# EAGLE design wiring1 (EAGLE 9.6.2)
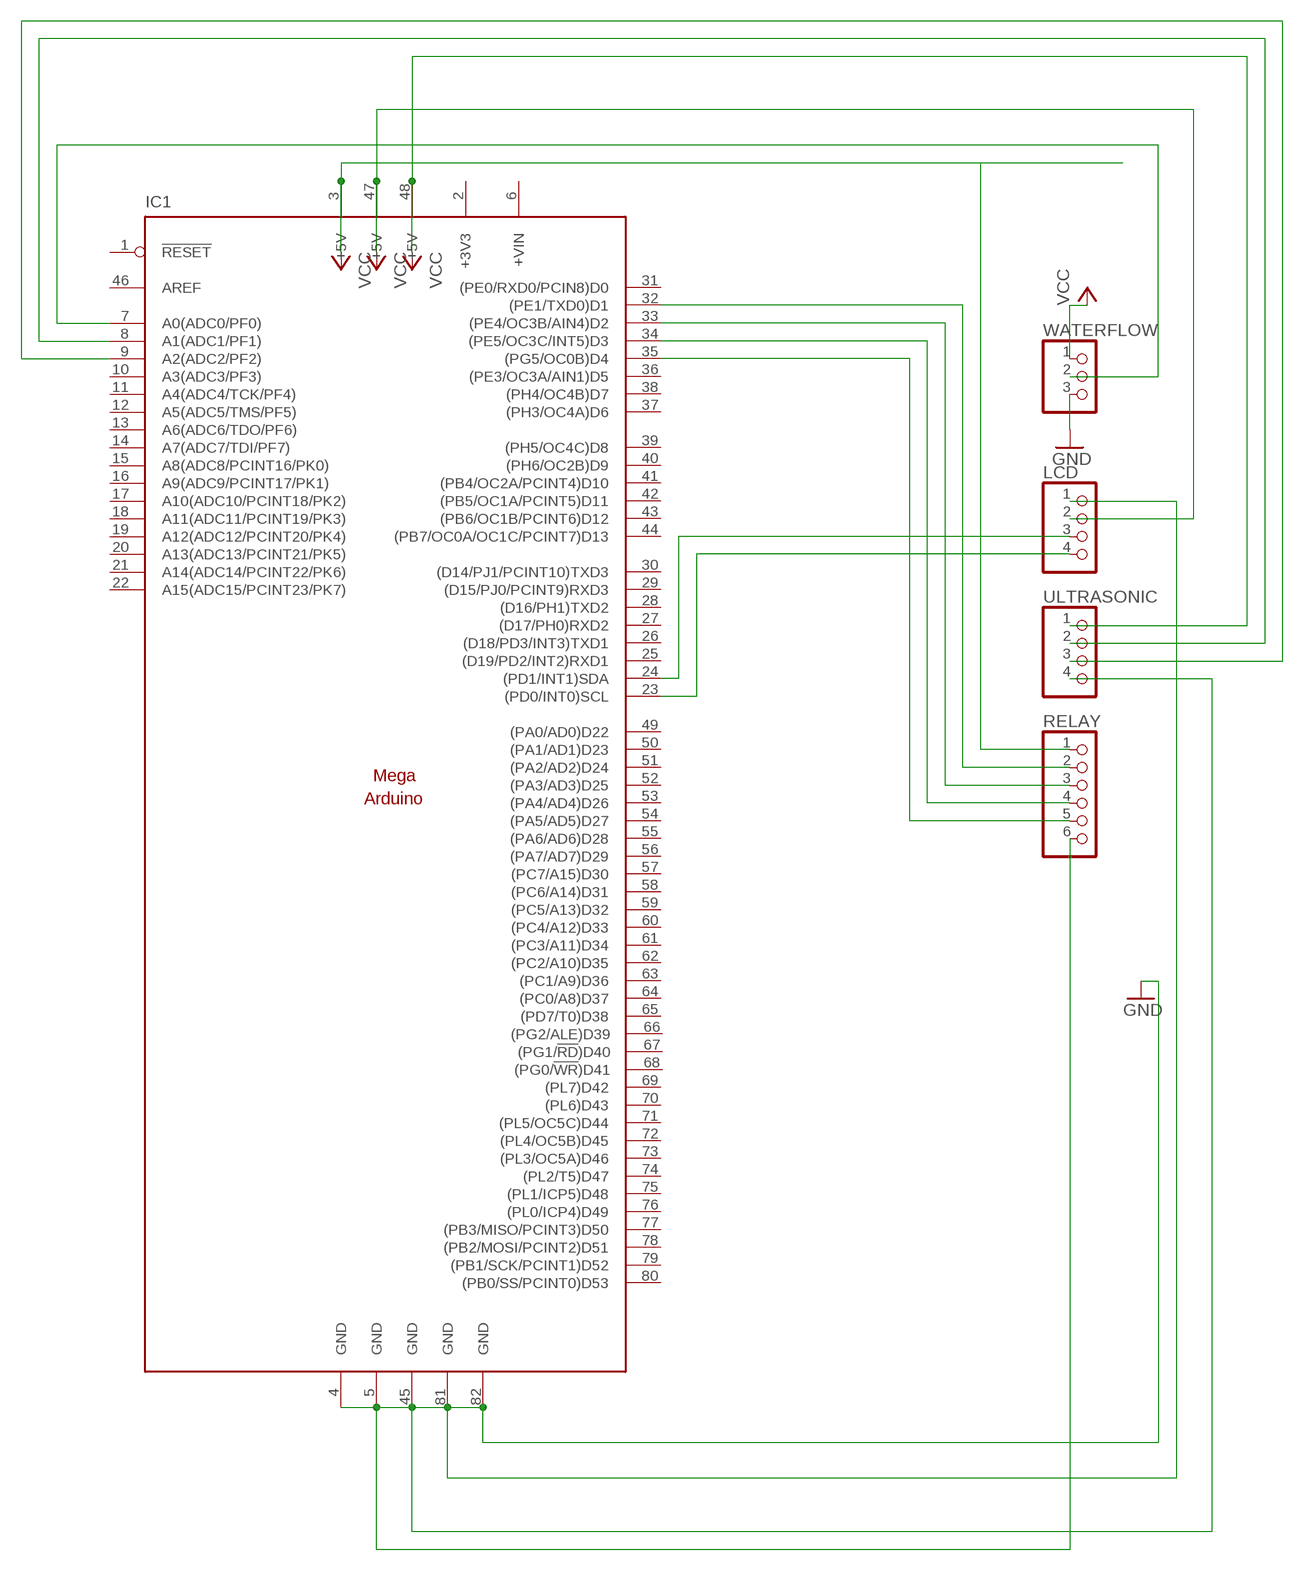
[diagram p0: schematic, sheet 1]

## Parts
IC1  ARDUINOMEGA  [ARDUINOMEGA]
LCD  PINHD-1X4  [1X04]
RELAY  PINHD-1X6  [1X06]
ULTRASONIC  PINHD-1X4  [1X04]
WATERFLOW  PINHD-1X3  [1X03]

## Nets
GND: IC1.4(GND) IC1.5(GND) IC1.45(GND) IC1.81(GND) IC1.82(GND) LCD.1 RELAY.6 ULTRASONIC.4 WATERFLOW.3
N$4: IC1.9(A2(ADC2/PF2)) ULTRASONIC.3
N$7: IC1.8(A1(ADC1/PF1)) ULTRASONIC.2
N$8: IC1.24((PD1/INT1)SDA) LCD.3
N$9: IC1.23((PD0/INT0)SCL) LCD.4
N$11: IC1.33((PE4/OC3B/AIN4)D2) RELAY.3
N$12: IC1.32((PE1/TXD0)D1) RELAY.2
N$13: IC1.34((PE5/OC3C/INT5)D3) RELAY.4
N$14: IC1.35((PG5/OC0B)D4) RELAY.5
N$15: IC1.7(A0(ADC0/PF0)) WATERFLOW.2
VCC: IC1.3(+5V) IC1.47(+5V) IC1.48(+5V) LCD.2 RELAY.1 ULTRASONIC.1 WATERFLOW.1
Unconnected: IC1.1(!RESET) IC1.10(A3(ADC3/PF3)) IC1.11(A4(ADC4/TCK/PF4)) IC1.12(A5(ADC5/TMS/PF5)) IC1.13(A6(ADC6/TDO/PF6)) IC1.14(A7(ADC7/TDI/PF7)) IC1.15(A8(ADC8/PCINT16/PK0)) IC1.16(A9(ADC9/PCINT17/PK1)) IC1.17(A10(ADC10/PCINT18/PK2)) IC1.18(A11(ADC11/PCINT19/PK3)) IC1.19(A12(ADC12/PCINT20/PK4)) IC1.20(A13(ADC13/PCINT21/PK5)) IC1.21(A14(ADC14/PCINT22/PK6)) IC1.22(A15(ADC15/PCINT23/PK7)) IC1.25((D19/PD2/INT2)RXD1) IC1.26((D18/PD3/INT3)TXD1) IC1.27((D17/PH0)RXD2) IC1.28((D16/PH1)TXD2) IC1.29((D15/PJ0/PCINT9)RXD3) IC1.30((D14/PJ1/PCINT10)TXD3) IC1.31((PE0/RXD0/PCIN8)D0) IC1.36((PE3/OC3A/AIN1)D5) IC1.37((PH3/OC4A)D6) IC1.38((PH4/OC4B)D7) IC1.39((PH5/OC4C)D8) IC1.40((PH6/OC2B)D9) IC1.41((PB4/OC2A/PCINT4)D10) IC1.42((PB5/OC1A/PCINT5)D11) IC1.43((PB6/OC1B/PCINT6)D12) IC1.44((PB7/OC0A/OC1C/PCINT7)D13) IC1.46(AREF) IC1.49((PA0/AD0)D22) IC1.50((PA1/AD1)D23) IC1.51((PA2/AD2)D24) IC1.52((PA3/AD3)D25) IC1.53((PA4/AD4)D26) IC1.54((PA5/AD5)D27) IC1.55((PA6/AD6)D28) IC1.56((PA7/AD7)D29) IC1.57((PC7/A15)D30) IC1.58((PC6/A14)D31) IC1.59((PC5/A13)D32) IC1.60((PC4/A12)D33) IC1.61((PC3/A11)D34) IC1.62((PC2/A10)D35) IC1.63((PC1/A9)D36) IC1.64((PC0/A8)D37) IC1.65((PD7/T0)D38) IC1.66((PG2/ALE)D39) IC1.67((PG1/!RD!)D40) IC1.68((PG0/!WR!)D41) IC1.69((PL7)D42) IC1.70((PL6)D43) IC1.71((PL5/OC5C)D44) IC1.72((PL4/OC5B)D45) IC1.73((PL3/OC5A)D46) IC1.74((PL2/T5)D47) IC1.75((PL1/ICP5)D48) IC1.76((PL0/ICP4)D49) IC1.77((PB3/MISO/PCINT3)D50) IC1.78((PB2/MOSI/PCINT2)D51) IC1.79((PB1/SCK/PCINT1)D52) IC1.80((PB0/SS/PCINT0)D53)

## Power pins joined to a net without a drawn wire
+3V3: IC1.2(+3V3)
+VIN: IC1.6(+VIN)

## Library data of the parts
IC1 = arduino mega 2560:ARDUINOMEGA: The Arduino Mega is a microcontroller board based on the ATmega1280. - 54 digital input/output pins (of which 14 can be used as PWM outputs) - 16 analog inputs - 4 UARTs (hardware serial ports) - 16 MHz crystal oscillator - USB connection - power jack - ICSP header - reset button It contains everything needed to support the microcontroller; simply connect it to a computer with a USB cable or power it with a AC-to-DC adapter or battery to get started. The Mega is compatible with most shields designed for the Arduino Duemilanove or Diecimila. http://arduino.cc/en/Main/ArduinoBoardMega
LCD ULTRASONIC = pinhead:PINHD-1X4: PIN HEADER
RELAY = pinhead:PINHD-1X6: PIN HEADER
WATERFLOW = pinhead:PINHD-1X3: PIN HEADER

## Board
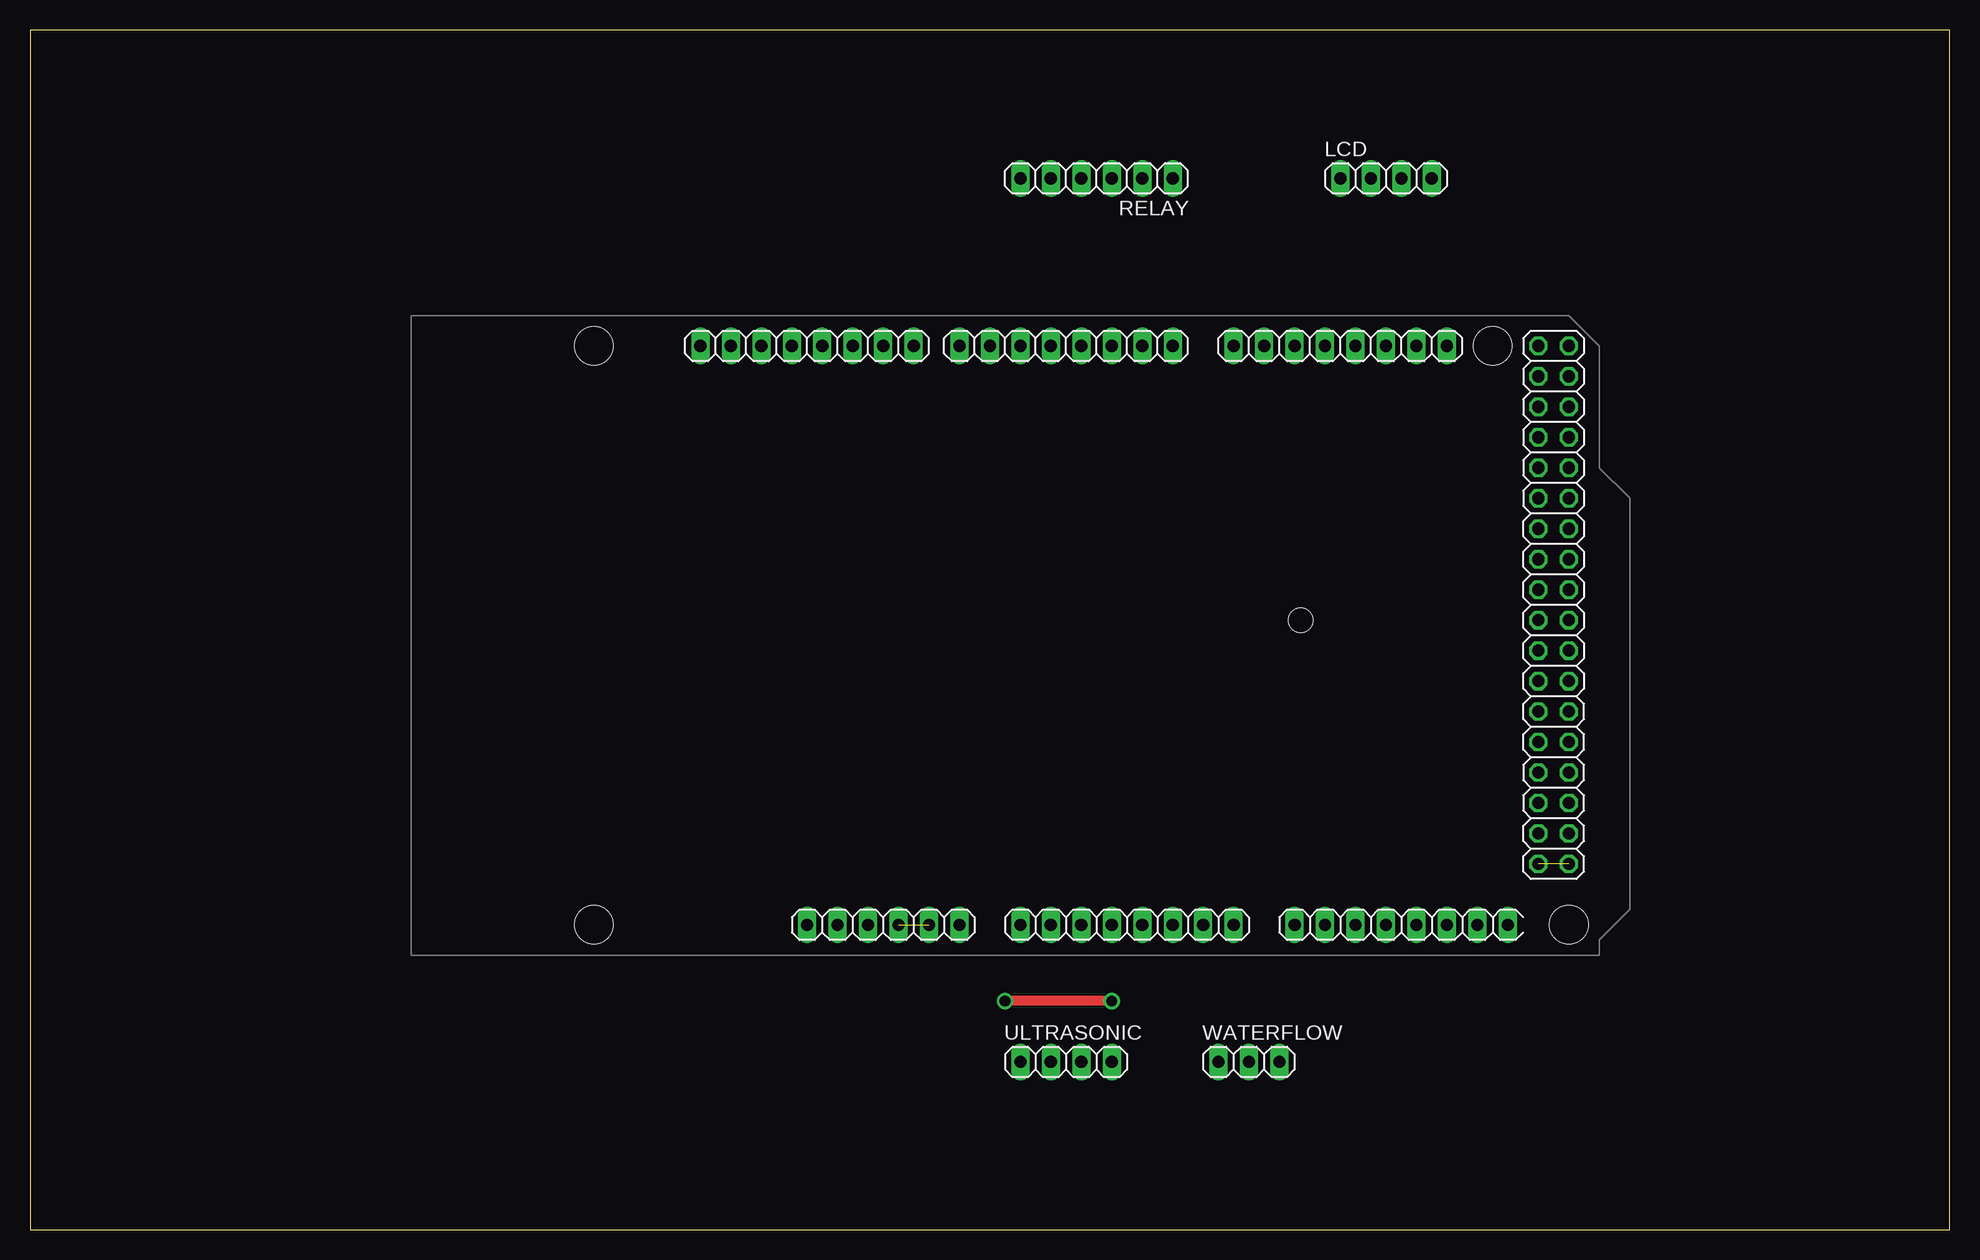
[diagram p1: board, top side]
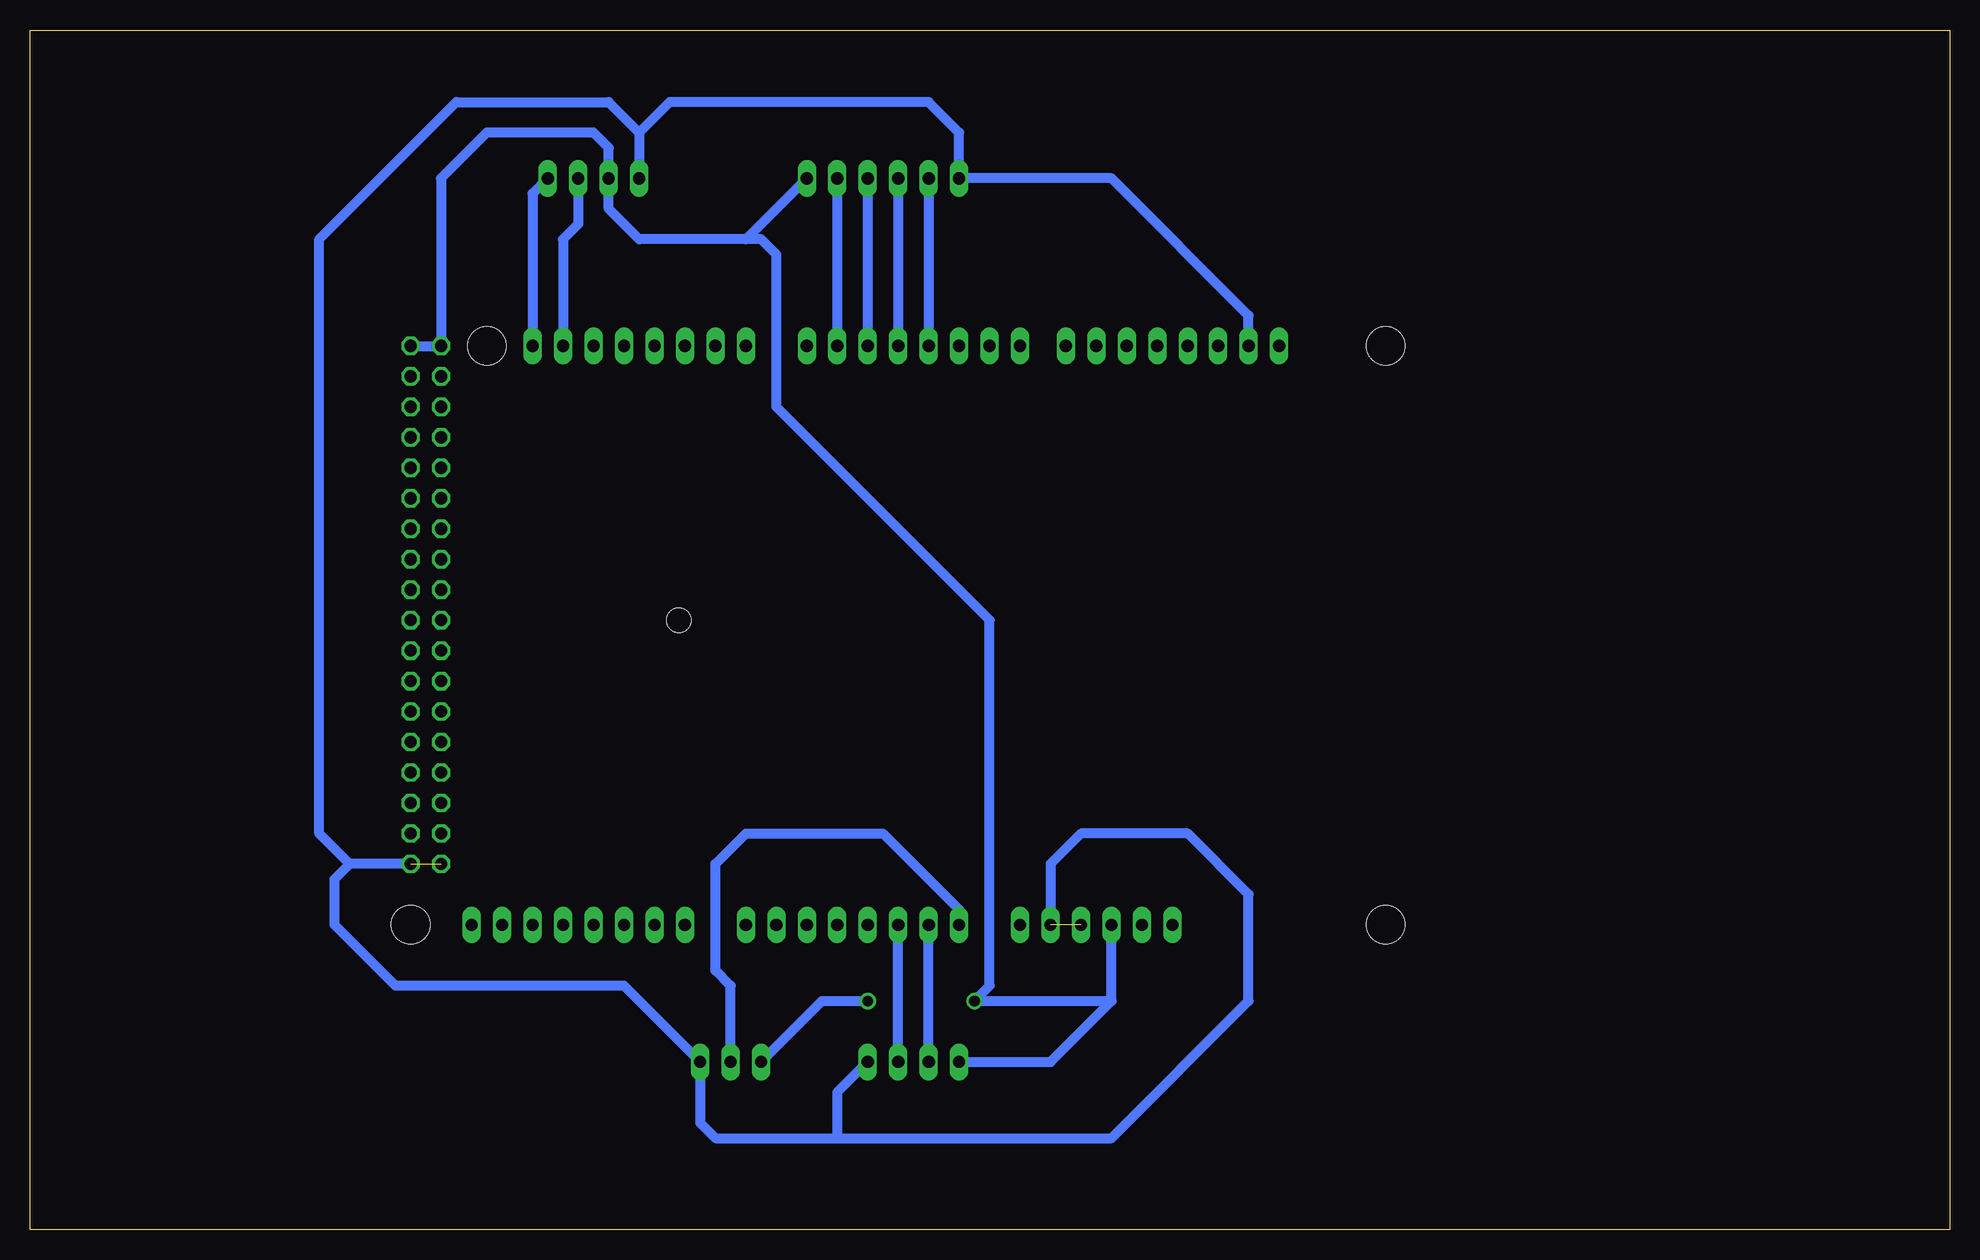
[diagram p2: board, bottom side, seen from below]

Size 160 x 100 mm. Coordinates in mm from the lower left corner, seen from the top.
Outline: 0,0 160,0 160,100 0,100 0,0
Copper layers (1*16): Top 0.035mm / dielectric 1.5mm / Bottom 0.035mm
Design rules "default": minimum track width 6mil, minimum drill 0.35mm, track to track 6mil, track to pad 6mil, pad to pad 6mil, via to via 6mil, smd to smd 6mil, copper to edge 40mil, drill to drill 6mil, minimum pad ring 10mil, minimum via ring 8mil, stop-mask expansion 4mil, vias tented up to drill 0mil, thermal gap 10mil

### Footprints (pad centres in the part's own frame; a part is rotated, then mirrored left to right if it is on the bottom)
ARDUINOMEGA = drill 1.016 long: 1 33.02,2.54; 2 35.56,2.54; 3 38.1,2.54; 4 40.64,2.54; 5 43.18,2.54; 6 45.72,2.54; 7 50.8,2.54; 8 53.34,2.54; 9 55.88,2.54; 10 58.42,2.54; 11 60.96,2.54; 12 63.5,2.54; 13 66.04,2.54; 14 68.58,2.54; 15 73.66,2.54; 16 76.2,2.54; 17 78.74,2.54; 18 81.28,2.54; 19 83.82,2.54; 20 86.36,2.54; 21 88.9,2.54; 22 91.44,2.54; 23 86.36,50.8; 24 83.82,50.8; 25 81.28,50.8; 26 78.74,50.8; 27 76.2,50.8; 28 73.66,50.8; 29 71.12,50.8; 30 68.58,50.8; 31 63.5,50.8; 32 60.96,50.8; 33 58.42,50.8; 34 55.88,50.8; 35 53.34,50.8; 36 50.8,50.8; 37 48.26,50.8; 38 45.72,50.8; 39 41.91,50.8; 40 39.37,50.8; 41 36.83,50.8; 42 34.29,50.8; 43 31.75,50.8; 44 29.21,50.8; 45 26.67,50.8; 46 24.13,50.8 | drill 1.016 octagon: 47 93.98,50.8; 48 96.52,50.8; 49 93.98,48.26; 50 96.52,48.26; 51 93.98,45.72; 52 96.52,45.72; 53 93.98,43.18; 54 96.52,43.18; 55 93.98,40.64; 56 96.52,40.64; 57 93.98,38.1; 58 96.52,38.1; 59 93.98,35.56; 60 96.52,35.56; 61 93.98,33.02; 62 96.52,33.02; 63 93.98,30.48; 64 96.52,30.48; 65 93.98,27.94; 66 96.52,27.94; 67 93.98,25.4; 68 96.52,25.4; 69 93.98,22.86; 70 96.52,22.86; 71 93.98,20.32; 72 96.52,20.32; 73 93.98,17.78; 74 96.52,17.78; 75 93.98,15.24; 76 96.52,15.24; 77 93.98,12.7; 78 96.52,12.7; 79 93.98,10.16; 80 96.52,10.16; 81 93.98,7.62; 82 96.52,7.62 | hole 3.2: 15.24,50.8; 15.24,2.54; 90.17,50.8; 96.52,2.54 | hole 2: 74.168,27.94
1X04 = drill 1.016 long: 1 -3.81,0; 2 -1.27,0; 3 1.27,0; 4 3.81,0
1X06 = drill 1.016 long: 1 -6.35,0; 2 -3.81,0; 3 -1.27,0; 4 1.27,0; 5 3.81,0; 6 6.35,0
1X03 = drill 1.016 long: 1 -2.54,0; 2 0,0; 3 2.54,0

### Placement (x,y rotation side)
IC1  31.75,22.86 0 top
LCD  113.03,87.63 0 top
RELAY  88.9,87.63 180 top
ULTRASONIC  86.36,13.97 0 top
WATERFLOW  101.6,13.97 0 top

### Tracks (layer width: path | path; a pad name or v marks a point on that pad's centre or on a via)
GND  (2 unrouted)
  Bottom 0.813: IC1.82 133.35,30.48 | 133.35,30.48 135.89,33.02 135.89,82.55 124.46,93.98 111.76,93.98 109.22,91.44 | 109.22,91.44 LCD.1 | 133.35,30.48 134.62,29.21 134.62,25.4 129.54,20.32 110.49,20.32 WATERFLOW.3 104.14,8.89 102.87,7.62 92.71,7.62 | 92.71,7.62 69.85,7.62 58.42,19.05 58.42,27.94 63.5,33.02 72.39,33.02 74.93,30.48 IC1.5 | ULTRASONIC.4 92.71,11.43 92.71,7.62 | 109.22,91.44 106.68,93.98 85.09,93.98 82.55,91.44 RELAY.6 69.85,87.63 58.42,76.2 IC1.45
N$4
  Bottom 0.813: ULTRASONIC.3 IC1.9
N$7
  Bottom 0.813: ULTRASONIC.2 IC1.8
N$8
  Bottom 0.813: IC1.24 115.57,82.55 114.3,83.82 LCD.3
N$9
  Bottom 0.813: LCD.4 118.11,86.36 IC1.23
N$11
  Bottom 0.813: RELAY.3 IC1.33
N$12
  Bottom 0.813: RELAY.2 IC1.32
N$13
  Bottom 0.813: RELAY.4 IC1.34
N$14
  Bottom 0.813: RELAY.5 IC1.35
N$15
  Bottom 0.813: WATERFLOW.2 101.6,20.32 102.87,21.59 102.87,30.48 100.33,33.02 88.9,33.02 82.55,26.67 IC1.7
VCC  (via drill 0.9 pad 1)
  Top 0.813: v90.17,19.05 v81.28,19.05
  Bottom 0.813: IC1.48 IC1.47 125.73,87.63 121.92,91.44 113.03,91.44 111.76,90.17 LCD.2 111.76,85.09 109.22,82.55 100.33,82.55 | ULTRASONIC.1 74.93,13.97 69.85,19.05 | 69.85,19.05 IC1.3 | RELAY.1 100.33,82.55 | WATERFLOW.1 93.98,19.05 v90.17,19.05 | 69.85,19.05 v81.28,19.05 80.01,20.32 80.01,50.8 97.79,68.58 97.79,81.28 99.06,82.55 100.33,82.55